# EAGLE design head procesing (EAGLE 7.4.0)
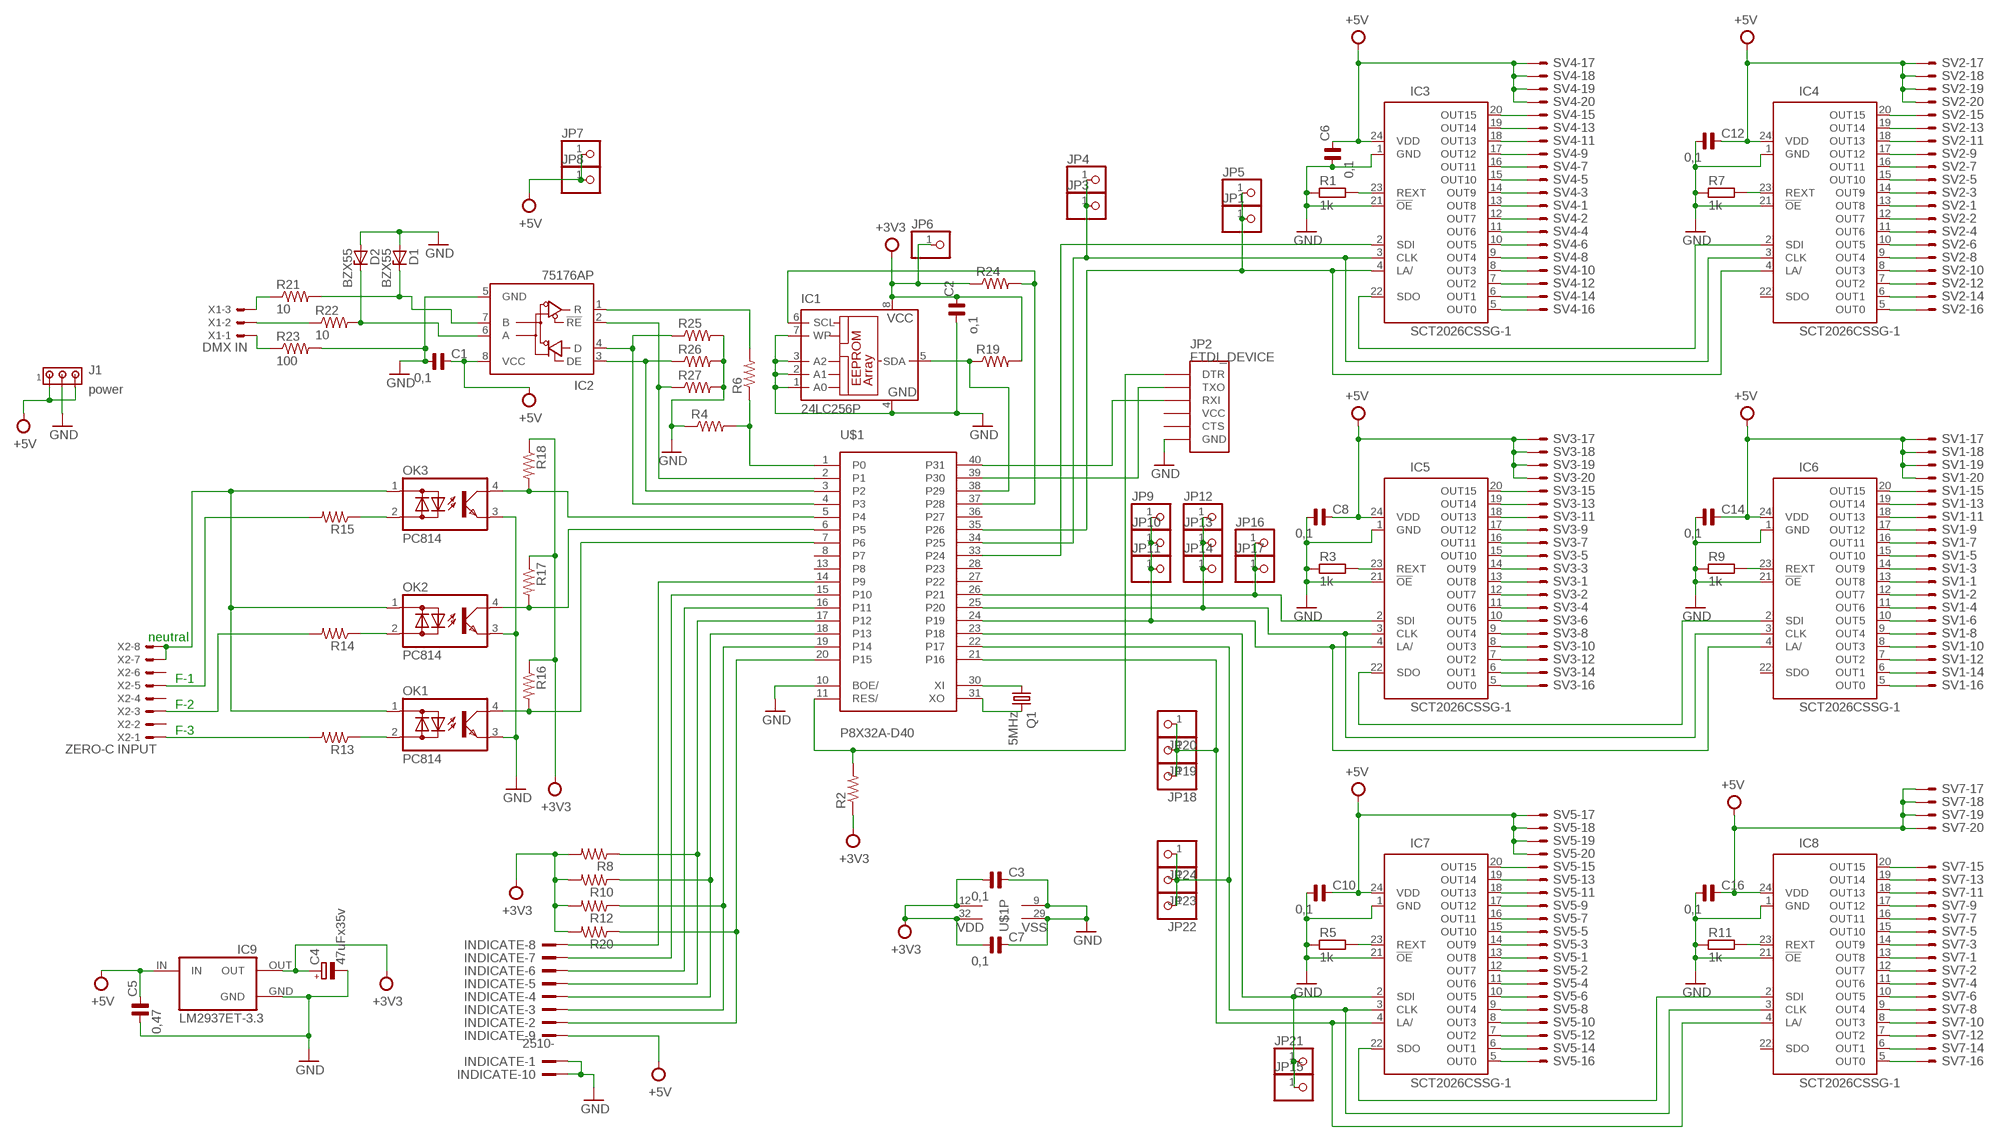
[diagram p0: schematic, sheet 1]

## Parts
C1  0,1  C-NP-5,0-7,5X3,5  [C5,0-7,5X3,5]
C2  o,1  C-NP-5,0-7,5X3,5  [C5,0-7,5X3,5]
C3  0,1  C-NP-5,0-7,5X3,5  [C5,0-7,5X3,5]
C4  47uFx35v  CPOL-EUE2-5  [E2-5]
C5  0,47  C-NP-5,0-7,5X3,5  [C5,0-7,5X3,5]
C6  0,1  C-NP-SMD-0805  [C-0805]
C7  0,1  C-NP-5,0-7,5X3,5  [C5,0-7,5X3,5]
C8  0,1  C-NP-SMD-0805  [C-0805]
C10  0,1  C-NP-SMD-0805  [C-0805]
C12  0,1  C-NP-SMD-0805  [C-0805]
C14  0,1  C-NP-SMD-0805  [C-0805]
C16  0,1  C-NP-SMD-0805  [C-0805]
D1  BZX55  [DO35Z10]
D2  BZX55  [DO35Z10]
IC1  24LC256P  [DIL8]
IC2  75176AP  [DIL08]
IC3  SCT2026CSSG-1  [SSOP24]
IC4  SCT2026CSSG-1  [SSOP24]
IC5  SCT2026CSSG-1  [SSOP24]
IC6  SCT2026CSSG-1  [SSOP24]
IC7  SCT2026CSSG-1  [SSOP24]
IC8  SCT2026CSSG-1  [SSOP24]
IC9  LM2937ET-3.3  [TO220(V)]
INDICATE  2510-  [PAK100/2500-10]
J1  power  350429-1  [350429-1]
JP1  PINHD-1X1  [1X01]
JP2  FTDI_DEVICE  [FTDI_DEVICE_SIDE]
JP3  PINHD-1X1  [1X01]
JP4  PINHD-1X1  [1X01]
JP5  PINHD-1X1  [1X01]
JP6  PINHD-1X1  [1X01]
JP7  PINHD-1X1  [1X01]
JP8  PINHD-1X1  [1X01]
JP9  PINHD-1X1  [1X01]
JP10  PINHD-1X1  [1X01]
JP11  PINHD-1X1  [1X01]
JP12  PINHD-1X1  [1X01]
JP13  PINHD-1X1  [1X01]
JP14  PINHD-1X1  [1X01]
JP15  PINHD-1X1  [1X01]
JP16  PINHD-1X1  [1X01]
JP17  PINHD-1X1  [1X01]
JP18  PINHD-1X1  [1X01]
JP19  PINHD-1X1  [1X01]
JP20  PINHD-1X1  [1X01]
JP21  PINHD-1X1  [1X01]
JP22  PINHD-1X1  [1X01]
JP23  PINHD-1X1  [1X01]
JP24  PINHD-1X1  [1X01]
OK1  PC814  [DIL04]
OK2  PC814  [DIL04]
OK3  PC814  [DIL04]
Q1  5MHz  CRYTALHC49U-V  [HC49U-V]
R1  1k  RESISTOR_0805  [RESC2012X70N]
R2  R-US_0207/10  [0207/10]
R3  1k  RESISTOR_0805  [RESC2012X70N]
R4  R-US_0207/10  [0207/10]
R5  1k  RESISTOR_0805  [RESC2012X70N]
R6  R-US_0207/10  [0207/10]
R7  1k  RESISTOR_0805  [RESC2012X70N]
R8  R-US_0207/10  [0207/10]
R9  1k  RESISTOR_0805  [RESC2012X70N]
R10  R-US_0207/10  [0207/10]
R11  1k  RESISTOR_0805  [RESC2012X70N]
R12  R-US_0207/10  [0207/10]
R13  R-US_0207/10  [0207/10]
R14  R-US_0207/10  [0207/10]
R15  R-US_0207/10  [0207/10]
R16  R-US_0207/10  [0207/10]
R17  R-US_0207/10  [0207/10]
R18  R-US_0207/10  [0207/10]
R19  R-US_0207/10  [0207/10]
R20  R-US_0207/10  [0207/10]
R21  10  R-US_0207/10  [0207/10]
R22  10  R-US_0207/10  [0207/10]
R23  100  R-US_0207/10  [0207/10]
R24  R-US_0207/10  [0207/10]
R25  R-US_0207/10  [0207/10]
R26  R-US_0207/10  [0207/10]
R27  R-US_0207/10  [0207/10]
SV1  ML20E  [ML20]
SV2  ML20E  [ML20]
SV3  ML20E  [ML20]
SV4  ML20E  [ML20]
SV5  ML20E  [ML20]
SV7  ML20E  [ML20]
U$1  P8X32A-D40  [P8X32A-D40]
X1  DMX IN  C-GRID-03-70543  [70543-03]
X2  ZERO-C INPUT  C-GRID-08-70543  [70543-08]

## Nets
+3V3: C2.2 C3.1 C4.+ C7.1 IC1.8(VCC) IC9.OUT JP6.1 R2.1 R8.2 R10.2 R12.2 R16.1 R17.1 R18.1 R19.2 R20.2 R24.1 U$1.12(VDD) U$1.32(VDD)
+5V: C1.2 C5.2 C6.2 C8.2 C10.2 C12.2 C14.2 C16.2 IC2.8(VCC) IC3.24(VDD) IC4.24(VDD) IC5.24(VDD) IC6.24(VDD) IC7.24(VDD) IC8.24(VDD) IC9.IN INDICATE.9 J1.1 J1.3 JP7.1 JP8.1 SV1.17 SV1.18 SV1.19 SV1.20 SV2.17 SV2.18 SV2.19 SV2.20 SV3.17 SV3.18 SV3.19 SV3.20 SV4.17 SV4.18 SV4.19 SV4.20 SV5.17 SV5.18 SV5.19 SV5.20 SV7.17 SV7.18 SV7.19 SV7.20
CLK: INDICATE.8 U$1.14(P9)
GND: C1.1 C2.1 C3.2 C4.- C5.1 C6.1 C7.2 C8.1 C10.1 C12.1 C14.1 C16.1 D1.A D2.A IC1.1(A0) IC1.2(A1) IC1.3(A2) IC1.4(GND) IC1.7(WP) IC2.5(GND) IC3.1(GND) IC3.21(!OE) IC4.1(GND) IC4.21(!OE) IC5.1(GND) IC5.21(!OE) IC6.1(GND) IC6.21(!OE) IC7.1(GND) IC7.21(!OE) IC8.1(GND) IC8.21(!OE) IC9.GND INDICATE.1 INDICATE.10 J1.2 JP2.P$6(GND) OK1.3(E) OK2.3(E) OK3.3(E) R1.1 R3.1 R4.1 R5.1 R7.1 R9.1 R11.1 R23.2 R25.2 R26.2 R27.2 U$1.9(VSS) U$1.10(BOE/) U$1.29(VSS)
LA/: INDICATE.6 U$1.16(P11)
N$1: OK1.4(C) R16.2 U$1.7(P6)
N$2: OK2.4(C) R17.2 U$1.6(P5)
N$3: OK3.4(C) R18.2 U$1.5(P4)
N$4: OK3.2(AC2) R15.1
N$5: R15.2 X2.5
N$6: IC2.3(DE) R26.1 U$1.3(P2)
N$7: OK2.2(AC2) R14.1
N$8: R14.2 X2.3
N$9: OK1.1(AC1) OK2.1(AC1) OK3.1(AC1) X2.7 X2.8
N$10: IC3.20(OUT15) SV4.15
N$11: OK1.2(AC2) R13.1
N$12: R13.2 X2.1
N$16: IC3.3(CLK) IC4.3(CLK) JP3.1 JP4.1 U$1.34(P25)
N$17: IC3.23(REXT) R1.2
N$18: IC3.19(OUT14) SV4.13
N$20: D2.C IC2.6(A) R22.2
N$21: D1.C IC2.7(B) R21.2
N$22: R4.2 R6.1 U$1.1(P0)
N$23: IC3.18(OUT13) SV4.11
N$25: IC5.23(REXT) R3.2
N$26: IC3.17(OUT12) SV4.9
N$28: IC4.23(REXT) R7.2
N$29: IC3.16(OUT11) SV4.7
N$31: IC6.23(REXT) R9.2
N$32: IC3.15(OUT10) SV4.5
N$33: IC3.2(SDI) U$1.33(P24)
N$34: IC7.23(REXT) R5.2
N$35: IC3.14(OUT9) SV4.3
N$36: IC3.4(LA/) IC4.4(LA/) JP1.1 JP5.1 U$1.35(P26)
N$37: IC8.23(REXT) R11.2
N$38: IC5.4(LA/) IC6.4(LA/) JP9.1 JP10.1 JP11.1 U$1.24(P19)
N$39: IC3.13(OUT8) SV4.1
N$40: IC3.12(OUT7) SV4.2
N$41: IC3.11(OUT6) SV4.4
N$42: IC1.5(SDA) R19.1 U$1.38(P29)
N$43: IC1.6(SCL) R24.2 U$1.37(P28)
N$44: Q1.1 U$1.30(XI)
N$45: IC5.3(CLK) IC6.3(CLK) JP12.1 JP13.1 JP14.1 U$1.25(P20)
N$46: IC5.2(SDI) JP16.1 JP17.1 U$1.26(P21)
N$48: IC3.22(SDO) IC4.2(SDI)
N$50: IC7.2(SDI) JP15.1 JP21.1 U$1.23(P18)
N$51: IC7.3(CLK) IC8.3(CLK) JP22.1 JP23.1 JP24.1 U$1.22(P17)
N$52: IC5.22(SDO) IC6.2(SDI)
N$56: IC7.22(SDO) IC8.2(SDI)
N$57: IC4.20(OUT15) SV2.15
N$58: IC6.20(OUT15) SV1.15
N$59: IC6.19(OUT14) SV1.13
N$60: IC6.18(OUT13) SV1.11
N$61: IC6.17(OUT12) SV1.9
N$62: IC6.16(OUT11) SV1.7
N$63: IC6.15(OUT10) SV1.5
N$64: IC6.14(OUT9) SV1.3
N$65: IC6.13(OUT8) SV1.1
N$66: IC6.12(OUT7) SV1.2
N$67: IC6.11(OUT6) SV1.4
N$68: IC6.10(OUT5) SV1.6
N$69: IC6.9(OUT4) SV1.8
N$70: IC6.8(OUT3) SV1.10
N$71: IC6.7(OUT2) SV1.12
N$72: IC6.6(OUT1) SV1.14
N$73: IC6.5(OUT0) SV1.16
N$74: IC4.19(OUT14) SV2.13
N$75: IC4.18(OUT13) SV2.11
N$76: IC4.17(OUT12) SV2.9
N$77: IC4.16(OUT11) SV2.7
N$78: IC4.15(OUT10) SV2.5
N$79: IC4.14(OUT9) SV2.3
N$80: IC4.13(OUT8) SV2.1
N$81: IC4.12(OUT7) SV2.2
N$82: IC4.11(OUT6) SV2.4
N$83: IC4.10(OUT5) SV2.6
N$84: IC4.9(OUT4) SV2.8
N$85: IC4.8(OUT3) SV2.10
N$86: IC4.7(OUT2) SV2.12
N$87: IC4.6(OUT1) SV2.14
N$88: IC4.5(OUT0) SV2.16
N$89: IC3.10(OUT5) SV4.6
N$90: IC7.20(OUT15) SV5.15
N$91: IC7.19(OUT14) SV5.13
N$92: IC7.18(OUT13) SV5.11
N$93: IC7.17(OUT12) SV5.9
N$94: IC7.16(OUT11) SV5.7
N$95: IC7.15(OUT10) SV5.5
N$96: IC7.14(OUT9) SV5.3
N$97: IC7.13(OUT8) SV5.1
N$98: IC7.12(OUT7) SV5.2
N$99: IC7.11(OUT6) SV5.4
N$100: IC7.10(OUT5) SV5.6
N$101: IC7.9(OUT4) SV5.8
N$102: IC7.8(OUT3) SV5.10
N$103: IC7.7(OUT2) SV5.12
N$104: IC7.6(OUT1) SV5.14
N$105: IC7.5(OUT0) SV5.16
N$106: IC8.20(OUT15) SV7.15
N$107: IC3.9(OUT4) SV4.8
N$108: IC5.20(OUT15) SV3.15
N$109: IC8.19(OUT14) SV7.13
N$110: IC8.18(OUT13) SV7.11
N$111: IC8.17(OUT12) SV7.9
N$112: IC8.16(OUT11) SV7.7
N$113: IC8.15(OUT10) SV7.5
N$114: IC8.14(OUT9) SV7.3
N$115: IC8.13(OUT8) SV7.1
N$116: IC8.12(OUT7) SV7.2
N$117: IC8.11(OUT6) SV7.4
N$118: IC8.10(OUT5) SV7.6
N$119: IC8.9(OUT4) SV7.8
N$120: IC8.8(OUT3) SV7.10
N$121: IC8.7(OUT2) SV7.12
N$122: IC8.6(OUT1) SV7.14
N$123: IC8.5(OUT0) SV7.16
N$124: IC5.19(OUT14) SV3.13
N$125: IC5.18(OUT13) SV3.11
N$126: IC5.17(OUT12) SV3.9
N$127: IC5.16(OUT11) SV3.7
N$128: IC5.15(OUT10) SV3.5
N$129: IC5.14(OUT9) SV3.3
N$130: IC5.13(OUT8) SV3.1
N$131: IC5.12(OUT7) SV3.2
N$132: IC5.11(OUT6) SV3.4
N$133: IC5.10(OUT5) SV3.6
N$134: IC5.9(OUT4) SV3.8
N$135: IC5.8(OUT3) SV3.10
N$136: IC5.7(OUT2) SV3.12
N$137: IC5.6(OUT1) SV3.14
N$138: IC5.5(OUT0) SV3.16
N$139: IC3.8(OUT3) SV4.10
N$140: IC3.7(OUT2) SV4.12
N$141: IC3.6(OUT1) SV4.14
N$142: IC3.5(OUT0) SV4.16
N$143: Q1.2 U$1.31(XO)
N$144: JP2.P$1(DTR) R2.2 U$1.11(RES/)
N$145: IC7.4(LA/) IC8.4(LA/) JP18.1 JP19.1 JP20.1 U$1.21(P16)
N$152: JP2.P$2(TXO) U$1.39(P30)
N$153: JP2.P$3(RXI) U$1.40(P31)
N$155: IC2.1(R) R6.2
N$158: IC2.2(!RE) R27.1 U$1.2(P1)
N$159: IC2.4(D) R25.1 U$1.4(P3)
N$161: R23.1 X1.1
N$162: R21.1 X1.3
N$163: R22.1 X1.2
S1-MENU: INDICATE.5 R8.1 U$1.17(P12)
S2-UP: INDICATE.4 R10.1 U$1.18(P13)
S3-DOWN: INDICATE.3 R12.1 U$1.19(P14)
S4-ENTER: INDICATE.2 R20.1 U$1.20(P15)
SDI: INDICATE.7 U$1.15(P10)
Unconnected: IC4.22(SDO) IC6.22(SDO) IC8.22(SDO) JP2.P$4(VCC) JP2.P$5(CTS) U$1.8(P7) U$1.13(P8) U$1.27(P22) U$1.28(P23) U$1.36(P27) X2.2 X2.4 X2.6

## Notes on the sheet
- neutral
- F-1
- F-2
- F-3

## Library data of the parts
C1-C3 C5-C8 C10 C12 C14 C16 = cap-pan40:C-NP: NON-POLARIZED FILM/CHIP
C4 = rcl:CPOL-EU: POLARIZED CAPACITOR, European symbol
D1 D2 = diode:BZX55: Z DIODE
IC1 = microchip-3:24*: Serial EEPROM I2C
IC2 = 751xx:75176A: DIFFERENTIAL BUS TRANSCEIVER Source: http://focus.ti.com/lit/ds/symlink/sn75176a.pdf
IC3-IC8 = SCT2026:SCT2026: StarChip Technology 16-bit Serial-In-Out Constant-Current LED Driver. Source: www.starchips.com.tw/pdf/datasheet/SCT2026V03_01.pdf
IC9 = lm2937:LM2937ET*: 400 and 500 mA Low Dropout Voltage Regulator NATIONAL SEMICONDUCTOR created by Peter.Hofmann@ph-tronic.de <mailto:Reter.Hofmann@ph-tronic.de> 10-2004 Rev.0
INDICATE = con-3m:2510-: 3M (TM) Pak 100 4-Wall Header Source: 3M
J1 = con-amp:350429-1: Universal MATE-N-LOK .250" Centerline, 600 V, 19 - 36 A max Source: http://catalog.tycoelectronics.com/ .. ENG_CD_350429_Y.pdf
JP1 JP3-JP24 = pinhead:PINHD-1X1: PIN HEADER
JP2 = SparkFun-Connectors:FTDI_DEVICE: Connector which mates to FTDI basic or FTDI cable.
OK1-OK3 = optocoupler-2:PC814: SHARP OPTO COUPLER
Q1 = crystal:CRYTAL: CRYSTAL
R1 R3 R5 R7 R9 R11 = ipc-7351-resistor:RESISTOR_
R2 R4 R6 R8 R10 R12-R27 = resistor:R-US_: RESISTOR, American symbol
SV1-SV5 SV7 = con-harting-ml:ML20?E: HARTING
U$1 = parallax_propeller:P8X32A-D40
X1 = con-molex:C-GRID-03: CONNECTOR wire to board 2.54 mm (0.100") pitch header
X2 = con-molex:C-GRID-08: CONNECTOR wire to board 2.54 mm (0.100") pitch header

## Board
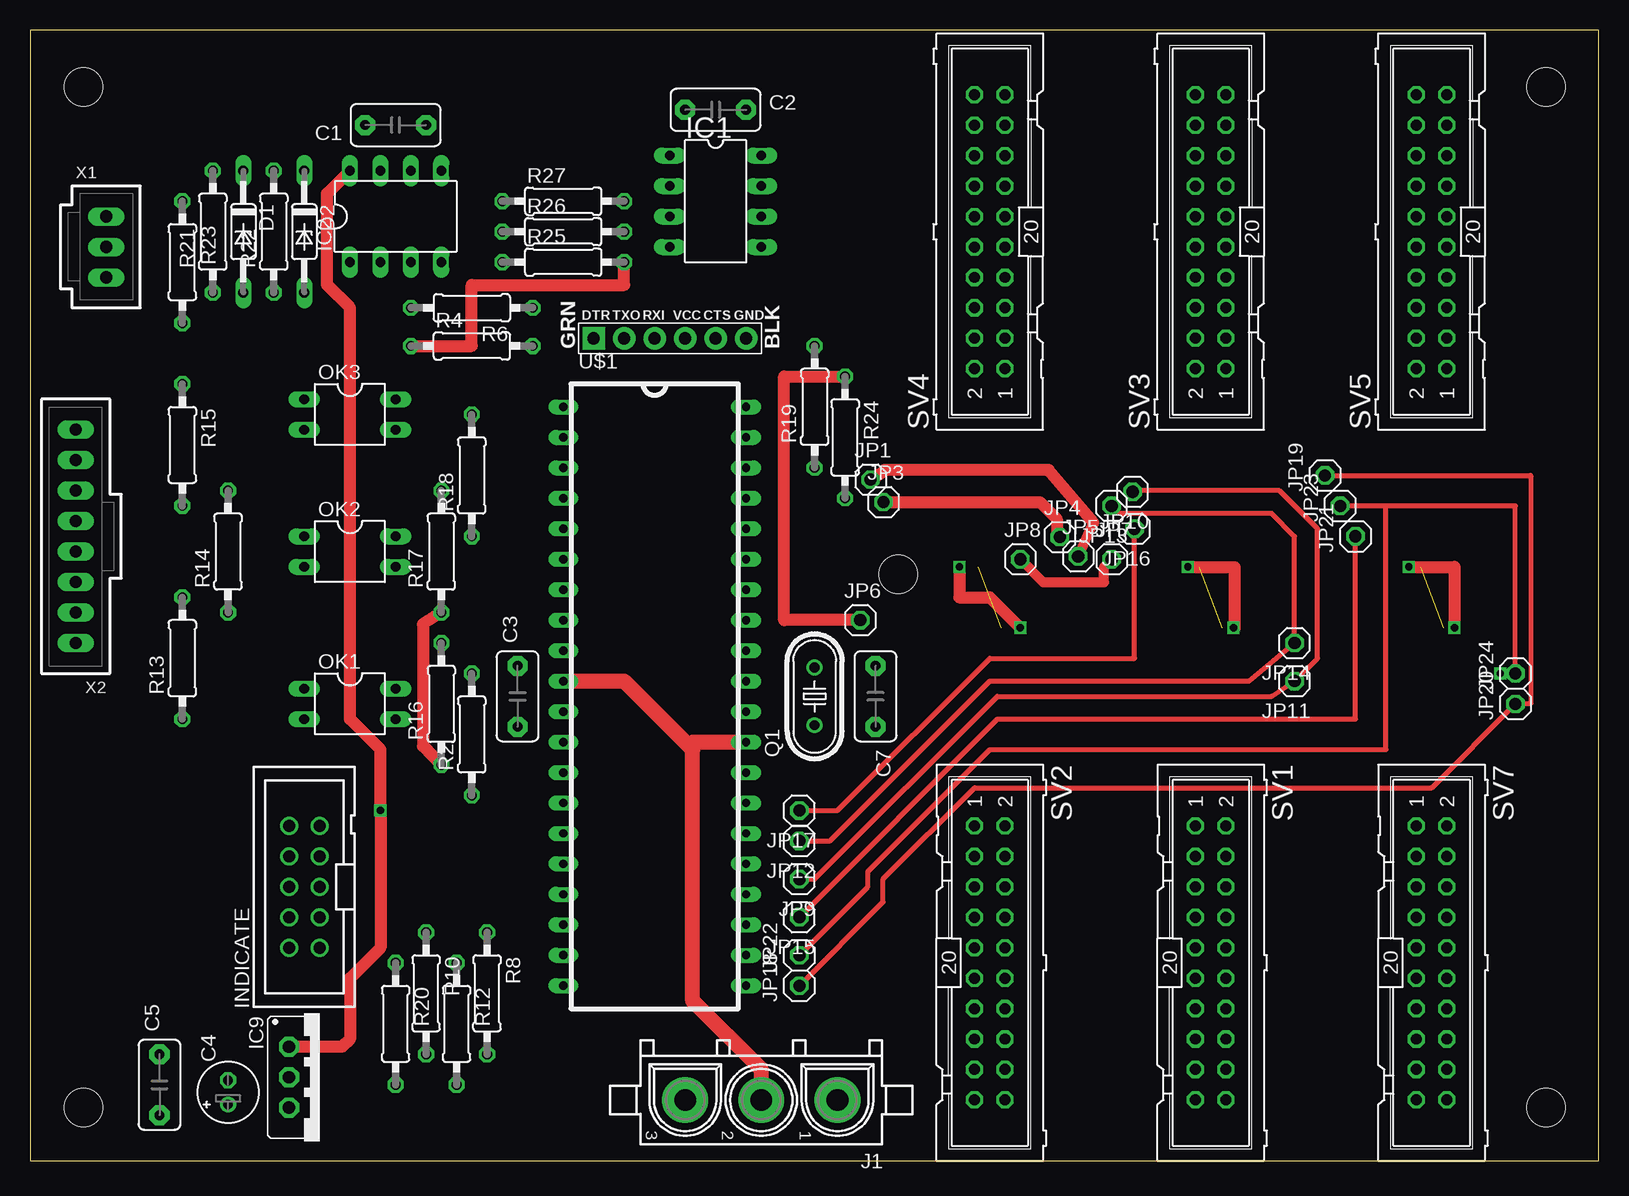
[diagram p1: board, top side]
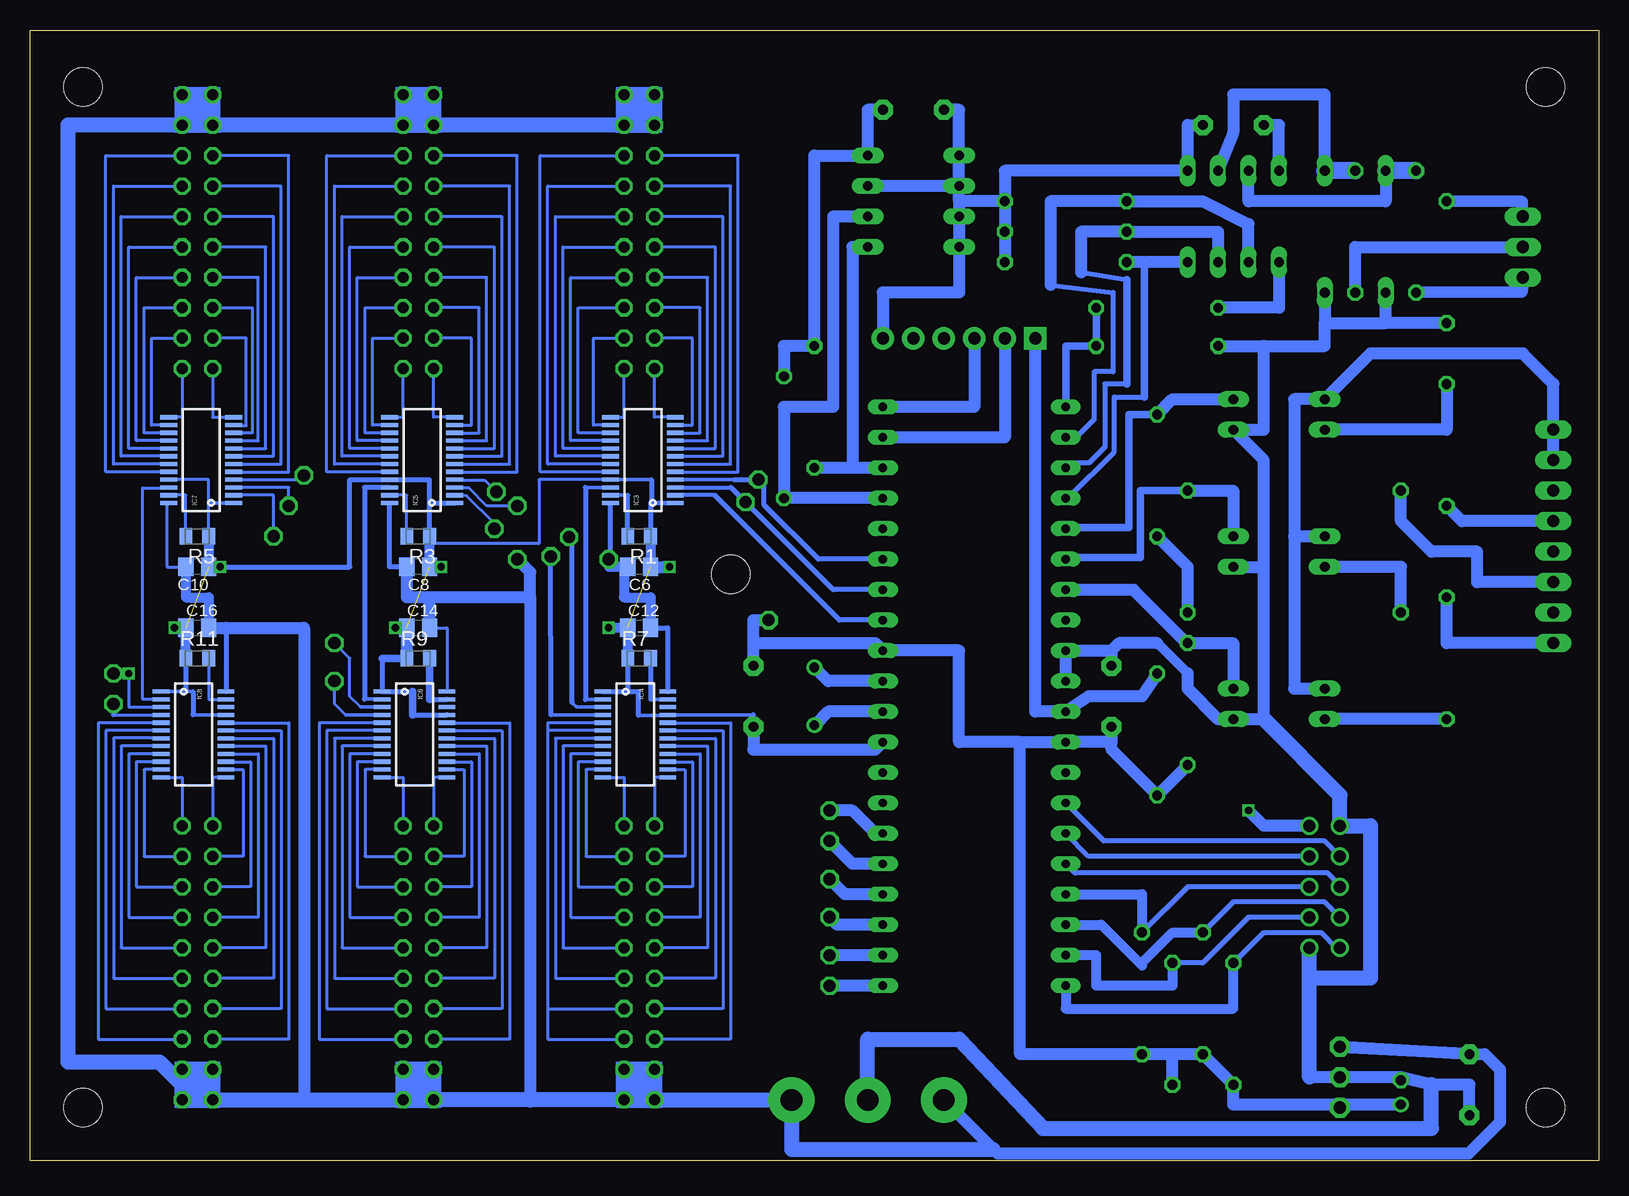
[diagram p2: board, bottom side, seen from below]

Size 130.79 x 94.28 mm. Coordinates in mm from the lower left corner, seen from the top.
Outline: 0,0 130.79,0 130.79,94.28 0,94.28 0,0
Copper layers (1*16): Top 0.035mm / dielectric 1.5mm / Bottom 0.035mm
Design rules "default": minimum track width 10mil, minimum drill 24mil, track to track 8mil, track to pad 8mil, pad to pad 8mil, via to via 8mil, smd to smd 8mil, copper to edge 40mil, drill to drill 8mil, minimum pad ring 10mil, minimum via ring 8mil, stop-mask expansion 4mil, vias tented up to drill 0mil, thermal gap 10mil
Holes 3.2 mm at 126.36,89.53 126.36,4.45 4.45,4.45 4.45,89.53 72.39,48.9

### Footprints (pad centres in the part's own frame; a part is rotated, then mirrored left to right if it is on the bottom)
C5,0-7,5X3,5 = drill 0.813 pad 1.676 octagon: 1 -2.54,0; 2 2.54,0
E2-5 = drill 0.813 pad 1.27: + -1.016,0 | drill 0.813 pad 1.27 octagon: - 1.016,0
C-0805 = smd 1.27 x 1.524: 1 -0.953,0; 2 0.953,0
DO35Z10 = drill 0.813 long: A 5.08,0; C -5.08,0
DIL8 = drill 0.813 long: 1 -3.81,-3.81; 2 -1.27,-3.81; 3 1.27,-3.81; 4 3.81,-3.81; 5 3.81,3.81; 6 1.27,3.81; 7 -1.27,3.81; 8 -3.81,3.81
DIL08 = drill 0.813 long: 1 -3.81,-3.81; 2 -1.27,-3.81; 3 1.27,-3.81; 4 3.81,-3.81; 5 3.81,3.81; 6 1.27,3.81; 7 -1.27,3.81; 8 -3.81,3.81
SSOP24 = smd 0.348 x 1.397: 1 -3.575,-3.021; 2 -2.925,-3.021; 3 -2.275,-3.021; 4 -1.625,-3.021; 5 -0.975,-3.021; 6 -0.325,-3.021; 7 0.325,-3.021; 8 0.975,-3.021; 9 1.625,-3.021; 10 2.275,-3.021; 11 2.925,-3.021; 12 3.575,-3.021; 13 3.575,2.386; 14 2.925,2.386; 15 2.275,2.386; 16 1.625,2.386; 17 0.975,2.386; 18 0.325,2.386; 19 -0.325,2.386; 20 -0.975,2.386; 21 -1.625,2.386; 22 -2.275,2.386; 23 -2.925,2.386; 24 -3.575,2.386
TO220(V) = drill 1.016 pad 1.676 octagon: GND 0,0; IN -2.54,0; OUT 2.54,0
PAK100/2500-10 = drill 1 pad 1.422: 1 -5.08,-1.27; 2 -5.08,1.27; 3 -2.54,-1.27; 4 -2.54,1.27; 5 0,-1.27; 6 0,1.27; 7 2.54,-1.27; 8 2.54,1.27; 9 5.08,-1.27; 10 5.08,1.27
350429-1 = drill 1.8 pad 3.81: 1 -6.35,0; 2 0,0; 3 6.35,0
1X01 = drill 1.016 octagon: 1 0,0
FTDI_DEVICE_SIDE = drill 1.016 pad 1.88 square: P$1 -6.35,0 | drill 1.016 pad 1.88: P$2 -3.81,0; P$3 -1.27,0; P$4 1.27,0; P$5 3.81,0; P$6 6.35,0
DIL04 = drill 0.813 long: 1 -1.27,-3.81; 2 1.27,-3.81; 3 1.27,3.81; 4 -1.27,3.81
HC49U-V = drill 0.813: 1 -2.413,0; 2 2.413,0
RESC2012X70N = smd 1.05 x 1.4: 1 -0.95,0; 2 0.95,0
0207/10 = drill 0.813 octagon: 1 -5.08,0; 2 5.08,0
ML20 = drill 0.914 octagon: 1 -11.43,-1.27; 2 -11.43,1.27; 3 -8.89,-1.27; 4 -8.89,1.27; 5 -6.35,-1.27; 6 -6.35,1.27; 7 -3.81,-1.27; 8 -3.81,1.27; 9 -1.27,-1.27; 10 -1.27,1.27; 11 1.27,-1.27; 12 1.27,1.27; 13 3.81,-1.27; 14 3.81,1.27; 15 6.35,-1.27; 16 6.35,1.27; 17 8.89,-1.27; 18 8.89,1.27; 19 11.43,-1.27; 20 11.43,1.27
P8X32A-D40 = drill 0.7 pad 1.27 long: 1 -7.62,23.495; 2 -7.62,20.955; 3 -7.62,18.415; 4 -7.62,15.875; 5 -7.62,13.335; 6 -7.62,10.795; 7 -7.62,8.255; 8 -7.62,5.715; 9 -7.62,3.175; 10 -7.62,0.635; 11 -7.62,-1.905; 12 -7.62,-4.445; 13 -7.62,-6.985; 14 -7.62,-9.525; 15 -7.62,-12.065; 16 -7.62,-14.605; 17 -7.62,-17.145; 18 -7.62,-19.685; 19 -7.62,-22.225; 20 -7.62,-24.765; 21 7.62,-24.765; 22 7.62,-22.225; 23 7.62,-19.685; 24 7.62,-17.145; 25 7.62,-14.605; 26 7.62,-12.065; 27 7.62,-9.525; 28 7.62,-6.985; 29 7.62,-4.445; 30 7.62,-1.905; 31 7.62,0.635; 32 7.62,3.175; 33 7.62,5.715; 34 7.62,8.255; 35 7.62,10.795; 36 7.62,13.335; 37 7.62,15.875; 38 7.62,18.415; 39 7.62,20.955; 40 7.62,23.495
70543-03 = drill 1.016 long: 1 -2.54,0; 2 0,0; 3 2.54,0
70543-08 = drill 1.016 long: 1 -8.89,0; 2 -6.35,0; 3 -3.81,0; 4 -1.27,0; 5 1.27,0; 6 3.81,0; 7 6.35,0; 8 8.89,0

### Placement (x,y rotation side)
C1  30.48,86.36 180 top
C2  57.15,87.63 0 top
C3  40.64,38.73 90 top
C4  16.51,5.71 90 top
C5  10.79,6.35 90 top
C6  80.01,49.53 180 bottom
C7  70.48,38.73 270 top
C8  98.42,49.53 180 bottom
C10  116.84,49.53 180 bottom
C12  80.01,44.45 0 bottom
C14  98.42,44.45 0 bottom
C16  116.84,44.45 0 bottom
D1  17.78,77.47 270 top
D2  22.86,77.47 270 top
IC1  57.15,80.01 270 top
IC2  30.48,78.74 0 top
IC3  80.01,58.42 90 bottom
IC4  80.01,35.56 270 bottom
IC5  98.42,58.42 90 bottom
IC6  98.42,35.56 270 bottom
IC7  116.84,58.42 90 bottom
IC8  116.84,35.56 270 bottom
IC9  21.59,6.99 270 top
INDICATE  22.86,22.86 90 top
J1  60.96,5.08 180 top
JP1  70.07,56.8 0 top
JP2  53.34,68.58 0 top
JP3  71.14,54.93 0 top
JP4  85.84,52.01 0 top
JP5  87.38,50.4 0 top
JP6  69.22,45.09 0 top
JP7  90.17,50.16 0 top
JP8  82.55,50.16 0 top
JP9  64.14,23.5 180 top
JP10  91.91,55.78 180 top
JP11  105.41,40.01 180 top
JP12  64.14,26.67 180 top
JP13  90.17,54.61 180 top
JP14  105.41,43.18 180 top
JP15  64.14,20.32 180 top
JP16  92.08,52.7 180 top
JP17  64.14,29.21 180 top
JP18  64.14,14.61 90 top
JP19  107.95,57.15 90 top
JP20  123.83,38.1 90 top
JP21  110.49,52.07 90 top
JP22  64.14,17.14 90 top
JP23  109.22,54.61 90 top
JP24  123.83,40.64 90 top
OK1  26.67,38.1 270 top
OK2  26.67,50.8 270 top
OK3  26.67,62.23 270 top
Q1  65.41,38.73 90 top
R1  80.01,52.07 180 bottom
R2  36.83,35.56 90 top
R3  98.42,52.07 180 bottom
R4  36.83,67.94 0 top
R5  116.84,52.07 180 bottom
R6  36.83,71.12 180 top
R7  80.01,41.91 0 bottom
R8  38.1,13.97 270 top
R9  98.42,41.91 0 bottom
R10  33.02,13.97 270 top
R11  116.84,41.91 0 bottom
R12  35.56,11.43 270 top
R13  12.7,41.91 90 top
R14  16.51,50.8 90 top
R15  12.7,59.69 270 top
R16  34.29,38.1 90 top
R17  34.29,50.8 90 top
R18  36.83,57.15 90 top
R19  65.41,62.87 90 top
R20  30.48,11.43 270 top
R21  15.24,77.47 90 top
R22  20.32,77.47 90 top
R23  12.7,74.93 270 top
R24  67.94,60.33 270 top
R25  44.45,74.93 0 top
R26  44.45,77.47 0 top
R27  44.45,80.01 0 top
SV1  98.42,16.51 270 top
SV2  80.01,16.51 270 top
SV3  98.42,77.47 90 top
SV4  80.01,77.47 90 top
SV5  116.84,77.47 90 top
SV7  116.84,16.51 270 top
U$1  52.07,39.37 0 top
X1  6.35,76.2 270 top
X2  3.81,52.07 90 top

### Tracks (layer width: path | path; a pad name or v marks a point on that pad's centre or on a via)
+3V3
  Top 1.016: R17.1 32.76,44.75 32.76,34.59 R16.1 | JP6.1 62.87,45.09 62.87,65.41 R24.1
  Bottom 0.813: IC9.OUT 21.59,4.7 C4.+
  Bottom 1.016: R16.1 R2.1 40.64,34.29 C3.1 40.64,34.92 U$1.12 48.26,34.92 | C7.1 70.48,43.18 | 70.48,43.18 60.33,43.18 U$1.32 53.34,42.55 53.34,34.92 48.26,34.92 | C4.+ 30.48,4.7 R20.2 R10.2 35.56,8.89 | 35.56,8.89 R8.2 48.26,8.89 48.26,34.92 | R12.2 35.56,8.89 | R17.1 34.29,49.53 R18.1 | C2.2 60.96,87.63 IC1.8 65.41,83.82 R19.2 67.94,67.94 R24.1 | 70.48,43.18 70.48,45.09 JP6.1
+5V  (via drill 0.6)
  Top 0.813: JP8.1 84.45,48.26 89.53,48.26 89.53,49.53 JP7.1
  Top 1.016: IC9.IN 26.04,9.53 26.67,10.16 26.67,15.24 29.21,17.78 v29.21,29.21 29.21,34.29 26.67,36.83 26.67,71.12 24.77,73.03 24.77,80.64 IC2.8
  Bottom 0.254: 97.5,44.45 C14.2 96.04,44.45 IC6.24 | IC7.24 119.38,54.84 119.38,49.53 C10.2
  Bottom 0.406: C12.2 77.62,44.45 IC4.24 | 82.4,49.53 IC3.24 | C6.2 81.28,49.53 | C8.2 100.81,49.53 IC5.24 | 114.45,44.45 IC8.24
  Bottom 0.813: 50.13,0.6 50.48,0.95 | C6.2 82.4,49.53 82.55,49.53 JP8.1 | 81.28,49.53 81.28,46.99 79.06,46.99 C12.2 | C10.2 117.79,46.99 115.89,46.99 C16.2
  Bottom 1.016: C5.2 IC9.IN 9.53,8.89 8.26,7.62 8.26,3.23 10.88,0.6 50.13,0.6 | 50.48,0.95 J1.3 | IC2.8 26.67,86.36 C1.2 | INDICATE.9 27.94,27.94 v29.21,29.21 | C8.2 99.38,47 97.5,47 | 97.5,47 97.5,44.45 | 97.5,47 89.1,47 | 89.1,47 89.1,5.08 | 89.1,47 89.1,49.09 JP7.1 | C16.2 114.45,44.45 107.95,44.45 107.95,5.08
  Bottom 1.27: SV1.20 SV1.19 | SV1.20 SV1.18 SV1.17 SV1.19 | SV2.20 SV2.18 SV2.17 SV2.19 | SV2.20 SV2.19 | SV2.19 J1.1 67.31,0.95 50.48,0.95 | SV2.20 89.1,5.08 SV1.19 | SV7.20 SV7.19 SV7.17 SV7.18 118.11,6.35 | 118.11,6.35 SV7.20 | SV7.20 107.95,5.08 SV1.20 | SV4.18 SV4.20 SV4.19 SV4.17 SV4.18 | SV4.18 SV3.18 | SV3.18 SV3.20 SV3.19 SV3.17 SV3.18 | SV3.18 SV5.18 | SV5.18 SV5.17 | SV5.18 SV5.20 SV5.19 SV5.17 | SV5.17 127.64,86.36 127.64,8.26 120.02,8.26 118.11,6.35
CLK
  Bottom 0.406: INDICATE.8 22.86,26.67 41.27,26.67 U$1.14
GND  (3 unrouted)
  Top 0.813: 49.53,40.01 54.61,34.92 55.24,34.92 U$1.29
  Top 1.016: R4.1 36.83,67.94 36.83,73.03 49.53,73.03 R25.2
  Top 1.27: J1.2 60.96,7.62 55.24,13.34 55.24,34.29 | 55.24,34.29 55.24,34.92 60.33,34.92 | U$1.10 49.53,40.01 55.24,34.29
  Bottom 0.254: 77.62,37.16 IC4.21 | IC3.21 88.36,56.8 | 88.36,56.8 | 88.36,56.8 88.36,51.47 97.08,51.47 R3.1 | IC5.21 | 97.5,54.84 97.47,54.84 | C14.1 | IC7.21 115.9,56.8 115.9,54.84 IC7.1 115.89,54.84 R5.1 | 117.79,39.13 IC8.1 | IC8.21 | R11.1
  Bottom 0.305: 80.09,37.16 77.62,37.16 | IC3.21 78.99,56.8 | 70.48,37.19 IC4.21 | IC8.1 117.2,39.13 | 117.2,37.2 IC8.21
  Bottom 0.34: 78.99,54.86 76.99,54.86 IC3.1 79.06,54.84
  Bottom 0.406: OK1.3 31.75,36.83 | C6.1 | R7.1 80.96,39.13 | IC4.1 80.96,39.13 | 80.96,39.13 80.09,39.13 80.09,37.16 | 78.99,56.8 78.99,54.86 | 79.06,54.84 R1.1 | C7.2 70.48,37.19 | R3.1 97.47,54.84 IC5.1 | IC5.21 97.5,56.8 97.5,54.84 | 101.45,41.91 IC6.1 98.9,39.13 | 98.9,37.19 IC6.21 | R11.1 117.79,39.13 | 117.2,39.13 117.2,37.2 | C10.1 104.14,49.53 104.14,56.8 IC5.21
  Bottom 0.61: 70.48,34.31 70.5,34.3 | R9.1 101.45,41.91 | 98.9,39.13 98.9,37.19
  Bottom 0.813: 16.51,6.99 C4.- | 34.29,40.64 36.83,43.18 | R1.1 C6.1 | R7.1 C12.1 82.55,44.45 | C8.1 R3.1 | R11.1 C16.1 | R5.1 C10.1
  Bottom 1.016: U$1.10 U$1.9 40.64,42.55 | 40.64,42.55 C3.2 | C7.2 70.48,34.31 | 70.5,34.3 60.31,34.3 U$1.29 | OK2.3 27.94,49.53 | 27.94,49.53 27.94,58.42 OK3.3 27.94,60.96 27.94,67.94 | OK1.3 27.94,36.83 27.94,49.53 | C5.1 10.79,6.35 13.97,6.35 16.51,6.99 IC9.GND 24.13,6.99 | R23.2 17.78,69.85 | 17.78,69.85 D1.A | D2.A 22.86,69.85 | 22.86,69.85 17.78,69.85 | C1.1 34.29,86.36 IC2.5 49.53,82.55 R27.2 | R27.2 R26.2 R25.2 | R27.2 53.34,80.01 | 53.34,80.01 IC1.2 | IC1.2 IC1.1 53.34,87.63 C2.1 | 53.34,80.01 IC1.3 IC1.4 53.34,72.39 59.69,72.39 JP2.P$6 | IC1.2 IC1.7 | 31.75,36.83 34.29,39.37 34.29,40.64 | 36.83,43.18 40.01,43.18 40.64,42.55 | R4.1 27.94,67.94 | 27.94,67.94 22.86,67.94 22.86,69.85 | C6.1 77.47,49.53 | C14.1 R9.1
  Bottom 1.27: 27.94,36.83 21.59,30.48 INDICATE.10 19.05,27.94 19.05,15.24 24.13,15.24 | 24.13,6.99 24.13,15.24 | 24.13,15.24 INDICATE.1 | J1.2 60.96,10.16 53.34,10.16 46.35,2.71 13.97,2.71 13.97,6.35
LA/
  Bottom 0.406: INDICATE.6 21.59,22.99 22.6,24 43.69,24 U$1.16
N$1
  Bottom 0.406: R16.2 34.38,43.18 | 44.42,47.6 U$1.7
  Bottom 1.016: R16.2 30.48,43.18 OK1.4 | 34.38,43.18 38.8,47.6 44.42,47.6
N$2
  Bottom 0.61: R17.2 38.23,55.88 38.23,50.3 44.45,50.3 U$1.6
  Bottom 1.016: R17.2 30.48,55.88 OK2.4
N$3
  Bottom 0.61: R18.2 39.2,62.23 39.2,52.8 44.45,52.8 U$1.5
  Bottom 1.016: R18.2 35.56,63.5 OK3.4
N$4
  Bottom 1.016: R15.1 12.7,60.96 OK3.2
N$5
  Bottom 1.016: X2.5 11.43,53.34 R15.2
N$6
  Bottom 0.406: 43.18,74.09 39.37,73.46 | 39.37,64.77 41.2,64.77 41.2,59.5 42.5,58.2 44.03,58.2 U$1.3
  Bottom 0.61: 39.37,73.46 39.37,64.77
  Bottom 1.016: IC2.3 31.75,77.47 R26.1 43.18,77.47 43.18,74.09
N$7
  Bottom 1.016: R14.1 16.51,49.53 OK2.2
N$8
  Bottom 1.016: X2.3 10.16,48.26 10.16,50.8 13.97,50.8 16.51,53.34 R14.2
N$9
  Bottom 1.016: X2.7 X2.8 3.81,64.77 6.35,67.31 19.05,67.31 OK3.1 25.4,63.5 25.4,52.07 | OK2.1 25.4,52.07 | 25.4,52.07 25.4,39.37 OK1.1
N$10
  Bottom 0.254: IC3.20 88.27,57.45 88.27,83.82 SV4.15
N$11
  Bottom 1.016: R13.1 OK1.2
N$12
  Bottom 1.016: X2.1 12.7,43.18 R13.2
N$13  (via drill 0.6)
  other vias: 29.21,29.21
N$15  (via drill 0.6)
  Top 1.016: v77.47,49.53 77.47,46.99 80.01,46.99 v82.55,44.45
N$16
  Top 0.406: 85.6,52.02 JP4.1
  Top 1.016: JP3.1 84.17,54.93 85.6,53.5 85.6,52.02
  Bottom 0.305: IC4.3 85.23,37.84 85.6,38.2
  Bottom 0.34: IC3.3 72.36,56.15
  Bottom 0.406: 85.6,38.2 85.6,52 JP4.1 | 72.36,56.15 JP3.1 63.84,47.62 U$1.34
N$17
  Bottom 0.305: 80.96,55.49 IC3.23
  Bottom 0.406: R1.2 80.96,55.49
N$18
  Bottom 0.254: IC3.19 87.63,58.09 87.63,81.28 SV4.13
N$19  (via drill 0.6)
  other vias: 96.52,49.53
N$20
  Bottom 1.016: D2.C 22.86,88.9 30.48,88.9 30.48,85.72 IC2.6
  Bottom 1.422: R22.2 D2.C
N$21
  Bottom 1.016: D1.C 17.78,80.01 29.21,80.01 IC2.7
  Bottom 1.422: R21.2 D1.C
N$22
  Bottom 0.61: R6.1 R4.2 44.45,67.94 U$1.1
N$23
  Bottom 0.254: IC3.18 87,58.74 87,78.74 SV4.11
N$24
  Top 1.016: 71.3,57.6 70,56.7
N$25
  Bottom 0.254: R3.2 99.38,55.49 IC5.23
N$26
  Bottom 0.254: IC3.17 86.36,59.4 86.36,76.2 SV4.9
N$28
  Bottom 0.305: 79.06,38.48 IC4.23
  Bottom 0.406: R7.2 79.06,38.48
N$29
  Bottom 0.254: IC3.16 85.72,60.05 85.72,73.66 SV4.7
N$30  (via drill 0.6)
  Top 1.016: v114.94,49.53 118.75,49.53 v118.75,44.45
N$31
  Bottom 0.406: 97.47,38.48 IC6.23
  Bottom 0.61: R9.2 97.47,38.48
N$32
  Bottom 0.254: IC3.15 85.09,60.7 85.09,71.12 SV4.5
N$33
  Bottom 0.254: IC3.2
  Bottom 0.34: 73.73,55.5 IC3.2
  Bottom 0.406: U$1.33 63.32,45.09 73.73,55.5
N$34
  Bottom 0.254: R5.2 117.79,55.49 IC7.23
N$35
  Bottom 0.254: IC3.14 83.82,61.34 83.82,68.58 SV4.3
N$36
  Top 0.406: 71.27,57.6 JP1.1
  Top 0.813: JP5.1 88.64,53.22
  Top 1.016: 88.64,53.22 84.9,57.6 71.27,57.6
  Bottom 0.305: IC3.4 72.08,56.8 | IC4.4 87.36,37.19
  Bottom 0.406: 72.08,56.8 JP1.1 69.6,56.53 69.6,54.7 65.06,50.16 U$1.35 | 87.36,37.19 JP5.1
N$37
  Bottom 0.254: R11.2 115.89,38.48 IC8.23
N$38
  Top 0.406: JP9.1 65.41,23.5 80.64,38.73 103.5,38.73 JP11.1 107.31,41.91 107.31,52.7 104.14,55.88 92.44,55.88 JP10.1
  Bottom 0.254: IC5.4 95.6,56.75 92.91,56.75 JP10.1 | 104.5,37.19 105.41,38.1 JP11.1
  Bottom 0.305: IC6.4 104.5,37.19
  Bottom 1.016: U$1.24 62.87,22.23 JP9.1
N$39
  Bottom 0.254: IC3.13 81.28,61.99 SV4.1
N$40
  Bottom 0.254: IC3.12 78.74,61.99 SV4.2
N$41
  Bottom 0.254: IC3.11 75.56,61.34 75.56,68.58 SV4.4
N$42
  Bottom 1.016: U$1.38 62.23,57.78 | 62.23,57.78 R19.1 | IC1.5 62.23,76.2 62.23,57.78
N$43
  Bottom 1.016: U$1.37 R24.2 67.94,62.87 63.84,62.87 63.84,78.74 IC1.6
N$44
  Bottom 1.016: U$1.30 64.26,37.47 Q1.1
N$45
  Top 0.406: JP12.1 66.67,26.67 80.01,40.01 101.6,40.01 JP14.1 105.41,52.07 103.5,53.98 90.81,53.98 JP13.1
  Bottom 0.254: JP13.1 92.71,54.61 94.2,56.1 95.36,56.1 IC5.3 | 103.24,37.84 104.14,38.73 104.14,41.91 JP14.1
  Bottom 0.305: IC6.3 103.24,37.84
  Bottom 1.016: U$1.25 62.23,24.77 JP12.1
N$46
  Top 0.406: JP17.1 67.31,29.21 80.01,41.91 92.08,41.91 JP16.1
  Bottom 0.254: JP16.1 92.08,53.14 94.38,55.45 95.25,55.49 IC5.2
  Bottom 1.016: U$1.26 60.33,27.3 62.23,29.21 JP17.1
N$47  (via drill 0.6)
  other vias: 100.33,44.45
N$48
  Bottom 0.254: 83.03,38.46 IC4.2
  Bottom 0.305: IC3.22 84.49,56.15 | 84.49,38.46 83.03,38.46
  Bottom 0.406: 84.49,56.15 84.49,38.46
N$49
  Top 1.016: 96.5,49.5 100.4,49.5 100.4,44.4
N$50
  Top 0.406: JP15.1 80.64,36.83 110.49,36.83 JP21.1
  Bottom 0.254: JP21.1 110.49,55.49 IC7.2
  Bottom 1.016: U$1.23 63.5,19.68 JP15.1
N$51  (via drill 0.6)
  Top 0.406: v122.56,40.64 JP24.1 123.83,54.61 113.03,54.61 | 113.03,54.61 JP23.1 | JP22.1 69.85,22.86 69.85,24.13 80.01,34.29 113.03,34.29 113.03,54.61
  Bottom 0.254: v122.56,40.64 122.56,37.84 IC8.3 | JP23.1 109.22,56.15 IC7.3
  Bottom 0.61: JP24.1 v122.56,40.64
  Bottom 1.016: U$1.22 JP22.1
N$52
  Bottom 0.254: 101.45,38.5 IC6.2
  Bottom 0.305: 102.9,38.5 101.45,38.5
  Bottom 0.406: IC5.22 102.9,56.15 102.9,38.5
N$56
  Bottom 0.254: IC8.2 121.4,38.48 121.4,56.1 119.23,56.1 IC7.22
N$57
  Bottom 0.254: IC4.20 72.39,36.53 72.39,10.16 SV2.15
N$58
  Bottom 0.254: IC6.20 90.81,36.53 90.81,10.16 SV1.15
N$59
  Bottom 0.254: IC6.19 91.44,35.88 91.44,12.7 SV1.13
N$60
  Bottom 0.254: IC6.18 92.08,35.23 92.08,15.24 SV1.11
N$61
  Bottom 0.254: IC6.17 92.71,34.59 92.71,17.78 SV1.9
N$62
  Bottom 0.254: IC6.16 93.34,33.94 93.34,20.32 SV1.7
N$63
  Bottom 0.254: IC6.15 93.98,33.28 93.98,22.86 SV1.5
N$64
  Bottom 0.254: IC6.14 94.61,32.63 94.61,25.4 SV1.3
N$65
  Bottom 0.254: IC6.13 97.16,31.98 SV1.1
N$66
  Bottom 0.254: IC6.12 99.69,31.98 SV1.2
N$67
  Bottom 0.254: IC6.11 102.87,32.63 102.87,25.4 SV1.4
N$68
  Bottom 0.254: IC6.10 103.5,33.28 103.5,22.86 SV1.6
N$69
  Bottom 0.254: IC6.9 104.14,33.94 104.14,20.32 SV1.8
N$70
  Bottom 0.254: IC6.8 104.78,34.59 104.78,17.78 SV1.10
N$71
  Bottom 0.254: IC6.7 105.41,35.23 105.41,15.24 SV1.12
N$72
  Bottom 0.254: IC6.6 106.05,35.88 106.05,12.7 SV1.14
N$73
  Bottom 0.254: IC6.5 106.68,36.53 106.68,10.16 SV1.16
N$74
  Bottom 0.254: IC4.19 73.03,35.88 73.03,12.7 SV2.13
N$75
  Bottom 0.254: IC4.18 73.66,35.23 73.66,15.24 SV2.11
N$76
  Bottom 0.254: IC4.17 74.3,34.59 74.3,17.78 SV2.9
N$77
  Bottom 0.254: IC4.16 74.93,33.94 74.93,20.32 SV2.7
N$78
  Bottom 0.254: IC4.15 75.56,33.28 75.56,22.86 SV2.5
N$79
  Bottom 0.254: IC4.14 76.2,32.63 76.2,25.4 SV2.3
N$80
  Bottom 0.254: IC4.13 78.74,31.98 SV2.1
N$81
  Bottom 0.254: IC4.12 81.28,31.98 SV2.2
N$82
  Bottom 0.254: IC4.11 84.45,32.63 84.45,25.4 SV2.4
N$83
  Bottom 0.254: IC4.10 85.09,33.28 85.09,22.86 SV2.6
N$84
  Bottom 0.254: IC4.9 85.72,33.94 85.72,20.32 SV2.8
N$85
  Bottom 0.254: IC4.8 86.36,34.59 86.36,17.78 SV2.10
N$86
  Bottom 0.254: IC4.7 87,35.23 87,15.24 SV2.12
N$87
  Bottom 0.254: IC4.6 87.63,35.88 87.63,12.7 SV2.14
N$88
  Bottom 0.254: IC4.5 87.63,36.53 87.63,10.16 SV2.16
N$89
  Bottom 0.254: IC3.10 74.93,60.7 74.93,71.12 SV4.6
N$90
  Bottom 0.254: IC7.20 124.46,57.45 124.46,83.82 SV5.15
N$91
  Bottom 0.254: IC7.19 123.83,58.09 123.83,81.28 SV5.13
N$92
  Bottom 0.254: IC7.18 123.19,58.74 123.19,78.74 SV5.11
N$93
  Bottom 0.254: IC7.17 122.56,59.4 122.56,76.2 SV5.9
N$94
  Bottom 0.254: IC7.16 121.92,60.05 121.92,73.66 SV5.7
N$95
  Bottom 0.254: IC7.15 121.28,60.7 121.28,71.12 SV5.5
N$96
  Bottom 0.254: IC7.14 120.65,61.34 120.65,68.58 SV5.3
N$97
  Bottom 0.254: SV5.1 118.11,61.99 IC7.13
N$98
  Bottom 0.254: SV5.2 115.57,61.99 IC7.12
N$99
  Bottom 0.254: IC7.11 113.82,61.3 112.76,61.3 112.76,68.58 SV5.4
N$100
  Bottom 0.254: SV5.6 112.26,71.12 112.26,60.7 IC7.10
N$101
  Bottom 0.254: IC7.9 111.76,60.05 111.76,73.66 SV5.8
N$102
  Bottom 0.254: IC7.8 111.12,59.4 111.12,76.2 SV5.10
N$103
  Bottom 0.254: IC7.7 110.49,58.74 110.49,78.74 SV5.12
N$104
  Bottom 0.254: IC7.6 109.86,58.09 109.86,81.28 SV5.14
N$105
  Bottom 0.254: IC7.5 109.22,57.45 109.22,83.82 SV5.16
N$106
  Bottom 0.254: IC8.20 109.22,36.53 109.22,10.16 SV7.15
N$107
  Bottom 0.254: IC3.9 74.3,60.05 74.3,73.66 SV4.8
N$108
  Bottom 0.254: IC5.20 106.05,57.45 106.05,83.82 SV3.15
N$109
  Bottom 0.254: IC8.19 109.86,35.88 109.86,12.7 SV7.13
N$110
  Bottom 0.254: IC8.18 110.49,35.23 110.49,15.24 SV7.11
N$111
  Bottom 0.254: IC8.17 111.12,34.59 111.12,17.78 SV7.9
N$112
  Bottom 0.254: IC8.16 111.76,33.94 111.76,20.32 SV7.7
N$113
  Bottom 0.254: IC8.15 112.39,33.28 112.39,22.86 SV7.5
N$114
  Bottom 0.254: IC8.14 113.03,32.63 113.03,25.4 SV7.3
N$115
  Bottom 0.254: IC8.13 115.57,31.98 SV7.1
N$116
  Bottom 0.254: IC8.12 118.11,31.98 SV7.2
N$117
  Bottom 0.254: IC8.11 121.28,32.63 121.28,25.4 SV7.4
N$118
  Bottom 0.254: IC8.10 121.92,33.28 121.92,22.86 SV7.6
N$119
  Bottom 0.254: IC8.9 122.56,33.94 122.56,20.32 SV7.8
N$120
  Bottom 0.254: IC8.8 123.19,34.59 123.19,17.78 SV7.10
N$121
  Bottom 0.254: IC8.7 120.65,35.23 120.65,35.26 123.83,35.26 123.83,15.24 SV7.12
N$122
  Bottom 0.254: IC8.6 124.46,35.88 124.46,12.7 SV7.14
N$123
  Bottom 0.254: IC8.5 125.09,36.53 125.09,10.16 SV7.16
N$124
  Bottom 0.254: IC5.19 105.41,58.09 105.41,81.28 SV3.13
N$125
  Bottom 0.254: IC5.18 104.78,58.74 104.78,78.74 SV3.11
N$126
  Bottom 0.254: IC5.17 104.14,59.4 104.14,76.2 SV3.9
N$127
  Bottom 0.254: IC5.16 103.5,60.05 103.5,73.66 SV3.7
N$128
  Bottom 0.254: IC5.15 102.87,60.7 102.87,71.12 SV3.5
N$129
  Bottom 0.254: IC5.14 102.23,61.34 102.23,68.58 SV3.3
N$130
  Bottom 0.254: IC5.13 99.69,61.99 SV3.1
N$131
  Bottom 0.254: IC5.12 97.16,61.99 SV3.2
N$132
  Bottom 0.254: IC5.11 93.98,61.34 93.98,68.58 SV3.4
N$133
  Bottom 0.254: IC5.10 93.34,60.7 93.34,71.12 SV3.6
N$134
  Bottom 0.254: IC5.9 92.71,60.05 92.71,73.66 SV3.8
N$135
  Bottom 0.254: IC5.8 92.08,59.4 92.08,76.2 SV3.10
N$136
  Bottom 0.254: IC5.7 91.44,58.74 91.44,78.74 SV3.12
N$137
  Bottom 0.254: IC5.6 90.81,58.09 90.81,81.28 SV3.14
N$138
  Bottom 0.254: IC5.5 90.17,57.45 90.17,83.82 SV3.16
N$139
  Bottom 0.254: IC3.8 73.66,59.4 73.66,76.2 SV4.10
N$140
  Bottom 0.254: IC3.7 73.03,58.74 73.03,78.74 SV4.12
N$141
  Bottom 0.254: IC3.6 72.39,58.09 72.39,81.28 SV4.14
N$142
  Bottom 0.254: IC3.5 71.75,57.45 71.75,83.82 SV4.16
N$143
  Bottom 1.016: U$1.31 64.26,40.01 Q1.2
N$144
  Bottom 1.016: JP2.P$1 46.99,37.47 U$1.11 42.55,38.73 38.1,38.73 R2.2
N$145
  Top 0.406: JP19.1 125.09,57.15 125.09,38.1 JP20.1 116.84,31.11 78.74,31.11 71.12,23.5 71.12,21.59 JP18.1
  Bottom 0.254: 123.83,37.19 IC8.4 | IC7.4 107.95,56.8 JP19.1
  Bottom 0.406: JP20.1 123.83,37.19
  Bottom 1.016: U$1.21 JP18.1
N$152
  Bottom 1.016: JP2.P$2 49.53,60.33 U$1.39
N$153
  Bottom 1.016: JP2.P$3 52.07,62.87 U$1.40
N$155
  Bottom 1.016: IC2.1 26.67,71.12 R6.2
N$158
  Bottom 0.406: 45.72,73.03 40.5,72.39 40.5,65.8 42.1,65.8 42.1,61.8 43.6,60.3 44.42,60.3 U$1.2
  Bottom 1.016: IC2.2 29.21,78.11 33.02,80.01 R27.1 45.72,80.01 45.72,73.03
N$159
  Bottom 0.406: U$1.4 44.26,55.24 40.4,59.1 40.4,63.7 37.9,63.7 | 37.9,74.93 37.8,74.93
  Bottom 0.61: 37.9,63.7 37.9,74.93
  Bottom 1.016: IC2.4 37.8,74.93 | 37.9,74.93 R25.1
N$161
  Bottom 1.016: X1.1 6.4,79.96 R23.1
N$162
  Bottom 1.016: X1.3 6.44,72.44 R21.1
N$163
  Bottom 1.016: R22.1 20.32,76.2 X1.2
S1-MENU
  Bottom 0.406: INDICATE.5 34.29,22.86 R8.1
  Bottom 0.813: U$1.17 38.1,22.23 R8.1
S2-UP
  Bottom 0.406: INDICATE.4 22.86,21.59 30.48,21.59 R10.1
  Bottom 0.813: U$1.18 41.48,19.68 38.1,16.3 38.1,16.51 35.56,19.05 R10.1
S3-DOWN
  Bottom 0.406: INDICATE.3 29.21,20.32 33.02,16.51 R12.1
  Bottom 0.813: R12.1 35.56,14.61 41.91,14.61 41.91,17.14 U$1.19
S4-ENTER
  Bottom 0.406: INDICATE.2 21.88,17.78 23.1,19 27.99,19 R20.1
  Bottom 0.813: U$1.20 44.45,12.7 30.48,12.7 R20.1
SDI
  Bottom 0.406: INDICATE.7 42.55,25.4 U$1.15
(copper drawn outside any net)
  shapes: Bottom area x6